# Altium schematic sheet 04-Control Circuit.schdoc
size 307 x 218 mm; Symbol: muban; Device: muban; @Project Name: 12345678; @Create Date: 2025-07-10; @Schematic Name: Mini Oscilloscope; @Page Count: 5; @Update Date: 2025-07-12; @Update Time: 08:21:58; @Page Name: 04-Control Circuit; @Page No: 4; @Create Time: 07:27:05; @Board Name: Base Board; Title Block Position: 3; Width: 1170; Height: 825; Region Start: 1; X Region Count: 6; Y Region Count: 4; Blade Width: 10; Description: 模拟题模板
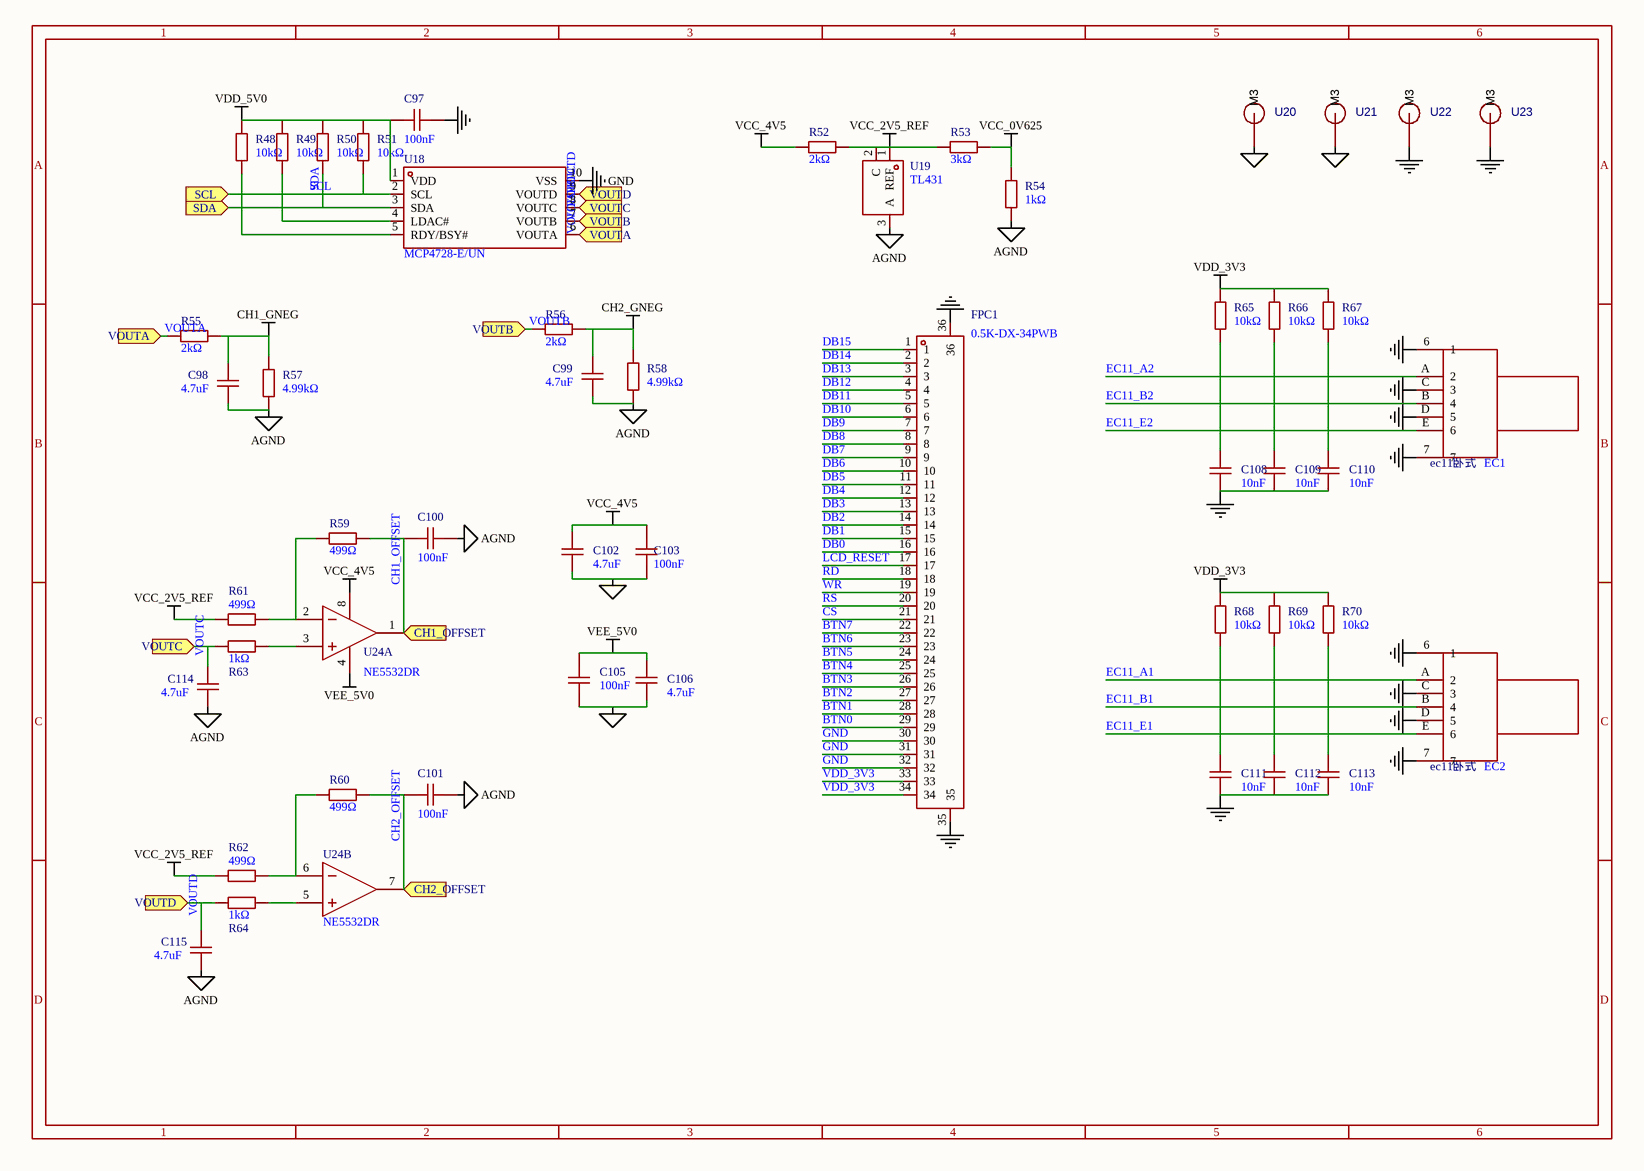
[diagram p0: 04-Control Circuit.schdoc]

## Parts
C97  100nF  [C0603]
C98  4.7uF  [C0603]
C99  4.7uF  [C0603]
C100  100nF  [C0603]
C101  100nF  [C0603]
C102  4.7uF  [C0603]
C103  100nF  [C0603]
C105  100nF  [C0603]
C106  4.7uF  [C0603]
C108  10nF  [C0603]
C109  10nF  [C0603]
C110  10nF  [C0603]
C111  10nF  [C0603]
C112  10nF  [C0603]
C113  10nF  [C0603]
C114  4.7uF  [C0603]
C115  4.7uF  [C0603]
EC1  (no value)  [ec11卧式立式编码器]
EC2  (no value)  [ec11卧式立式编码器]
FPC1  0.5K-DX-34PWB  [FPC-SMD_F0502-B-34-15T-R]
R48  10kΩ  [R0603]
R49  10kΩ  [R0603]
R50  10kΩ  [R0603]
R51  10kΩ  [R0603]
R52  2kΩ  [R0603]
R53  3kΩ  [R0603]
R54  1kΩ  [R0603]
R55  2kΩ  [R0603]
R56  2kΩ  [R0603]
R57  4.99kΩ  [R0603]
R58  4.99kΩ  [R0603]
R59  499Ω  [R0603]
R60  499Ω  [R0603]
R61  499Ω  [R0603]
R62  499Ω  [R0603]
R63  1kΩ  [R0603]
R64  1kΩ  [R0603]
R65  10kΩ  [R0603]
R66  10kΩ  [R0603]
R67  10kΩ  [R0603]
R68  10kΩ  [R0603]
R69  10kΩ  [R0603]
R70  10kΩ  [R0603]
U18  MCP4728-E/UN  [MSOP-10_L3.0-W3.0-P0.50-LS5.0-TL]
U19  TL431  [SOT-23-3_L3.0-W1.7-P0.95-LS2.9-BR]
U20  (no value)  [M3螺柱]
U21  (no value)  [M3螺柱]
U22  (no value)  [M3螺柱]
U23  (no value)  [M3螺柱]
U24  NE5532DR  [SOIC-8_L4.9-W3.9-P1.27-LS6.0-BL]  (parts A,B of 2)

## Ports
CH1_OFFSET (in), CH2_OFFSET (in), SCL (in), SDA (in), VOUTA (in), VOUTB (in), VOUTC (in), VOUTD (in)

## Nets
AGND: C98.1 C99.1 C100.1 C101.1 C102.1 C103.1 C105.1 C106.1 C114.1 C115.1 R54.1 R57.1 R58.1 U19.3(A) U20.1(M3) U21.1(M3)
CH1_GNEG: C98.2 R55.1 R57.2
CH2_GNEG: C99.2 R56.1 R58.2
GND: C97.1 C108.1 C109.1 C110.1 C111.1 C112.1 C113.1 EC1.6(1) EC1.7 EC1.C(3) EC1.D(5) EC2.6(1) EC2.7 EC2.C(3) EC2.D(5) FPC1.30 FPC1.31 FPC1.32 FPC1.35 FPC1.36 U18.10(VSS) U22.1(M3) U23.1(M3)
VCC_0V625: R53.2 R54.2
VCC_2V5_REF: R52.1 R53.1 R61.1 R62.1 U19.1(REF) U19.2(C)
VCC_4V5: C102.2 C103.2 R52.2 U24.8(VCC+)
VDD_3V3: FPC1.33 FPC1.34 R65.2 R66.2 R67.2 R68.2 R69.2 R70.2
VDD_5V0: C97.2 R48.2 R49.2 R50.2 R51.2 U18.1(VDD)
VEE_5V0: C105.2 C106.2 U24.4(VCC-/GND)
BTN0: FPC1.29
BTN1: FPC1.28
BTN2: FPC1.27
BTN3: FPC1.26
BTN4: FPC1.25
BTN5: FPC1.24
BTN6: FPC1.23
BTN7: FPC1.22
CH1_OFFSET: C100.2 R59.2 U24.1(OUT1) ; port CH1_OFFSET
CH2_OFFSET: C101.2 R60.2 U24.7(OUT2) ; port CH2_OFFSET
CS: FPC1.21
DB0: FPC1.16
DB1: FPC1.15
DB2: FPC1.14
DB3: FPC1.13
DB4: FPC1.12
DB5: FPC1.11
DB6: FPC1.10
DB7: FPC1.9
DB8: FPC1.8
DB9: FPC1.7
DB10: FPC1.6
DB11: FPC1.5
DB12: FPC1.4
DB13: FPC1.3
DB14: FPC1.2
DB15: FPC1.1
EC11_A1: C111.2 EC2.A(2) R68.1
EC11_A2: C108.2 EC1.A(2) R65.1
EC11_B1: C112.2 EC2.B(4) R69.1
EC11_B2: C109.2 EC1.B(4) R66.1
EC11_E1: C113.2 EC2.E(6) R70.1
EC11_E2: C110.2 EC1.E(6) R67.1
LCD_RESET: FPC1.17
RD: FPC1.18
RS: FPC1.20
SCL: R51.1 U18.2(SCL) ; port SCL
SDA: R50.1 U18.3(SDA) ; port SDA
VOUTA: R55.2 U18.6(VOUTA) ; port VOUTA
VOUTB: R56.2 U18.7(VOUTB) ; port VOUTB
VOUTC: C114.2 R63.1 U18.8(VOUTC) ; port VOUTC
VOUTD: C115.2 R64.1 U18.9(VOUTD) ; port VOUTD
WR: FPC1.19
NetR48_1: R48.1 U18.5(RDY/BSY#)
NetR49_1: R49.1 U18.4(LDAC#)
NetR59_1: R59.1 R61.2 U24.2(IN1-)
NetR60_1: R60.1 R62.2 U24.6(IN2-)
NetR63_2: R63.2 U24.3(IN1+)
NetR64_2: R64.2 U24.5(IN2+)

## Notes on the sheet
- 1
- 2
- 3
- 4
- 5
- 6
- A
- B
- C
- D

## Library data of the parts
C97 C103 C105 = CGA0603X7R104K500JT: Manufacturer: HRE(芯声); Symbol: CC0603KRX7R9BB104; Add into BOM: yes; Tolerance: ±10%; Voltage Rated: 50V; Temperature Coefficient: X7R; Device: CGA0603X7R104K500JT; LCSC Part Name: 100nF ±10% 50V; Supplier Part: C6119867; Manufacturer Part: CGA0603X7R104K500JT; Supplier Footprint: 0603; JLCPCB Part Class: Extended Part; Datasheet: https://atta.szlcsc.com/upload/public/pdf/source/20250103/C44077DA9E7B3EFAE02F22B6D3D1CBC9.pdf; Supplier: LCSC; Convert to PCB: yes; Value: 100nF; Voltage Rating: 50V
C98 C99 C102 C106 C114 C115 = CL10A475KO8NNNC: Manufacturer: SAMSUNG(三星); Add into BOM: yes; Tolerance: ±10%; Voltage Rated: 16V; Temperature Coefficient: X5R; Symbol: CL10A475KO8NNNC; Device: CL10A475KO8NNNC; LCSC Part Name: 4.7uF ±10% 16V; Supplier Part: C19666; Manufacturer Part: CL10A475KO8NNNC; Supplier Footprint: 0603; JLCPCB Part Class: Basic Part; Datasheet: https://atta.szlcsc.com/upload/public/pdf/source/20160218/1457707763339.pdf; Supplier: LCSC; Convert to PCB: yes; Value: 4.7uF
C100 C101 = CGA0603X7R104K500JT: Manufacturer: HRE(芯声); Add into BOM: yes; Tolerance: ±10%; Voltage Rated: 50V; Temperature Coefficient: X7R; Symbol: CGA0603X7R104K500JT; Device: CGA0603X7R104K500JT; LCSC Part Name: 100nF ±10% 50V; Supplier Part: C6119867; Manufacturer Part: CGA0603X7R104K500JT; Supplier Footprint: 0603; JLCPCB Part Class: Extended Part; Datasheet: https://atta.szlcsc.com/upload/public/pdf/source/20250103/C44077DA9E7B3EFAE02F22B6D3D1CBC9.pdf; Supplier: LCSC; Convert to PCB: yes; Value: 100nF; Voltage Rating: 50V
C108-C113 = CC0603KRX7R9BB103: Manufacturer: YAGEO(国巨); Add into BOM: yes; Tolerance: ±10%; Voltage Rated: 50V; Temperature Coefficient: X7R; Symbol: CC0603KRX7R9BB103; Device: CC0603KRX7R9BB103; LCSC Part Name: 10nF ±10% 50V; Supplier Part: C100042; Manufacturer Part: CC0603KRX7R9BB103; Supplier Footprint: 0603; JLCPCB Part Class: Extended Part; Datasheet: https://atta.szlcsc.com/upload/public/pdf/source/20181008/C309510_22F155564471FAF6A489F7D68F34234E.pdf; Supplier: LCSC; Convert to PCB: yes; Value: 10nF
EC1 EC2 = ec11卧式: Symbol: ec11卧式 厚底 带开关; Add into BOM: yes; Device: ec11卧式; Convert to PCB: yes
FPC1 = 0.5K-DX-34PWB: Manufacturer: HDGC(华德共创); Symbol: F0502-B-34-15T-R; Add into BOM: yes; Locking Feature: 翻盖式; Number of Contacts: 34P; Pitch: 0.5mm; FFC, FCB Thickness: 0.3mm; Device: 0.5K-DX-34PWB; LCSC Part Name: 间距:0.5mm P数:34P 翻盖式 下接; Supplier Part: C2911857; Manufacturer Part: 0.5K-DX-34PWB; Supplier Footprint: SMD,P=0.5mm,卧贴; JLCPCB Part Class: Extended Part; Datasheet: https://atta.szlcsc.com/upload/public/pdf/source/20211029/5210AEC837E1AC9B697C39805C1E664F.pdf; Supplier: LCSC; Convert to PCB: yes; Contact Type: 下接; Mounting Type: 卧贴; Height Above Board: 2mm; Operating Temperature Range: -20℃~+85℃
R48-R51 R65-R70 = 0603WAF1002T5E: Manufacturer: UNI-ROYAL(厚声); Add into BOM: yes; Tolerance: ±1%; Power(Watts): 100mW; Temperature Coefficient: ±100ppm/℃; Overload Voltage (Max): 75V; Symbol: 0603WAF1002T5E; Device: 0603WAF1002T5E; LCSC Part Name: 厚膜电阻 10kΩ ±1% 100mW; Supplier Part: C25804; Manufacturer Part: 0603WAF1002T5E; Supplier Footprint: 0603; JLCPCB Part Class: Basic Part; Datasheet: https://atta.szlcsc.com/upload/public/pdf/source/20200306/C422600_1E6D84923E4A46A82E41ADD87F860B5C.pdf; Supplier: LCSC; Convert to PCB: yes; Type: 厚膜电阻; Value: 10kΩ; Operating Temperature Range: -55℃~+155℃
R52 R55 R56 = 0603WAF2001T5E: Manufacturer: UNI-ROYAL(厚声); Add into BOM: yes; Tolerance: ±1%; Power(Watts): 100mW; Overload Voltage (Max): 75V; Temperature Coefficient: ±100ppm/℃; Symbol: 0603WAF2001T5E; Device: 0603WAF2001T5E; LCSC Part Name: 2kΩ ±1% 100mW 厚膜电阻; Supplier Part: C22975; Manufacturer Part: 0603WAF2001T5E; Supplier Footprint: 0603; JLCPCB Part Class: Basic Part; Datasheet: https://atta.szlcsc.com/upload/public/pdf/source/20200306/C422600_1E6D84923E4A46A82E41ADD87F860B5C.pdf; Supplier: LCSC; Convert to PCB: yes; Type: 厚膜电阻; Value: 2kΩ; Operating Temperature Range: -55℃~+155℃
R53 = 0603WAF3001T5E: Manufacturer: UNI-ROYAL(厚声); Add into BOM: yes; Tolerance: ±1%; Power(Watts): 100mW; Overload Voltage (Max): 75V; Temperature Coefficient: ±100ppm/℃; Symbol: 0603WAF3001T5E; Device: 0603WAF3001T5E; LCSC Part Name: 3kΩ ±1% 100mW 厚膜电阻; Supplier Part: C4211; Manufacturer Part: 0603WAF3001T5E; Supplier Footprint: 0603; JLCPCB Part Class: 基础库; Datasheet: https://atta.szlcsc.com/upload/public/pdf/source/20200306/C422600_1E6D84923E4A46A82E41ADD87F860B5C.pdf; Supplier: LCSC; Convert to PCB: yes; Type: 厚膜电阻; Value: 3kΩ; Operating Temperature Range: -55℃~+155℃
R54 R63 R64 = 0603WAF1001T5E: Manufacturer: UNI-ROYAL(厚声); Add into BOM: yes; Tolerance: ±1%; Power(Watts): 100mW; Overload Voltage (Max): 75V; Temperature Coefficient: ±100ppm/℃; Symbol: 0603WAF1001T5E; Device: 0603WAF1001T5E; LCSC Part Name: 1kΩ ±1% 100mW 厚膜电阻; Supplier Part: C21190; Manufacturer Part: 0603WAF1001T5E; Supplier Footprint: 0603; JLCPCB Part Class: Basic Part; Datasheet: https://atta.szlcsc.com/upload/public/pdf/source/20200306/C422600_1E6D84923E4A46A82E41ADD87F860B5C.pdf; Supplier: LCSC; Convert to PCB: yes; Type: 厚膜电阻; Value: 1kΩ; Operating Temperature Range: -55℃~+155℃
R57 R58 = 0603WAF4991T5E: Manufacturer: UNI-ROYAL(厚声); Add into BOM: yes; Tolerance: ±1%; Power(Watts): 100mW; Overload Voltage (Max): 75V; Temperature Coefficient: ±100ppm/℃; Symbol: 0603WAF4991T5E; Device: 0603WAF4991T5E; LCSC Part Name: 4.99kΩ ±1% 100mW 厚膜电阻; Supplier Part: C23046; Manufacturer Part: 0603WAF4991T5E; Supplier Footprint: 0603; JLCPCB Part Class: 基础库; Datasheet: https://atta.szlcsc.com/upload/public/pdf/source/20200306/C422600_1E6D84923E4A46A82E41ADD87F860B5C.pdf; Supplier: LCSC; Convert to PCB: yes; Type: 厚膜电阻; Value: 4.99kΩ; Operating Temperature Range: -55℃~+155℃
R59-R62 = 0603WAF4990T5E: Manufacturer: UNI-ROYAL(厚声); Add into BOM: yes; Tolerance: ±1%; Power(Watts): 100mW; Overload Voltage (Max): 75V; Temperature Coefficient: ±100ppm/℃; Symbol: 0603WAF4990T5E; Device: 0603WAF4990T5E; LCSC Part Name: 499Ω ±1% 100mW 厚膜电阻; Supplier Part: C23065; Manufacturer Part: 0603WAF4990T5E; Supplier Footprint: 0603; JLCPCB Part Class: 扩展库; Datasheet: https://atta.szlcsc.com/upload/public/pdf/source/20200306/C422600_1E6D84923E4A46A82E41ADD87F860B5C.pdf; Supplier: LCSC; Convert to PCB: yes; Type: 厚膜电阻; Value: 499Ω; Operating Temperature Range: -55℃~+155℃
U18 = MCP4728-E/UN: Manufacturer: MICROCHIP(美国微芯); Add into BOM: yes; Interface: I2C; Output Type: 电压-缓冲; Supply Voltage: 2.7V~5.5V; Resolution: 12位; Integral nonlinearity: ±0.2LSB；±2LSB; Settling Time: 6us; Symbol: MCP4728-E/UN; Device: MCP4728-E/UN; LCSC Part Name: MCP4728-E/UN; Supplier Part: C108207; Manufacturer Part: MCP4728-E/UN; Supplier Footprint: MSOP-10; JLCPCB Part Class: 扩展库; Datasheet: https://atta.szlcsc.com/upload/public/pdf/source/20180207/C108207_15179947749381359004.pdf; Supplier: LCSC; Convert to PCB: yes; Number of Channels: -; Operating Temperature: -40℃~+125℃
U19 = TL431_C181103: Manufacturer: Hottech(合科泰); Add into BOM: yes; Output Type: 可调; Output Voltage: 2.5V~36V; Output Current: 100mA; Minimum Cathode Current for Regulation: 1mA; Symbol: TL431_C181103; Device: TL431_C181103; LCSC Part Name: TL431; Supplier Part: C181103; Manufacturer Part: TL431; Supplier Footprint: SOT-23; JLCPCB Part Class: 扩展库; Datasheet: https://atta.szlcsc.com/upload/public/pdf/source/20220427/4F1D45E1F0D60AF688A54057C5935F69.pdf; Supplier: LCSC; Convert to PCB: yes; Operating Temperature: 0℃~+70℃@(TA)
U20-U23 = M3螺柱: Symbol: M3螺柱孔_JX; Convert to PCB: yes; Device: M3螺柱; Add into BOM: yes
U24 = NE5532DR: Manufacturer: TI(德州仪器); Add into BOM: yes; Number of Circuits: 双路; Gain Bandwidth Product(GBP): 10MHz; Current - Input Bias(Ib): 200nA; Slew Rate(SR): 9V/us; Output Current: 38mA; Supply Current: 8mA; Relevance: []; Symbol: NE5532DR; Device: NE5532DR; LCSC Part Name: NE5532DR; Supplier Part: C7426; Manufacturer Part: NE5532DR; Supplier Footprint: SOIC-8; JLCPCB Part Class: 基础库; Datasheet: http://www.ti.com/cn/lit/gpn/ne5532; Supplier: LCSC; Convert to PCB: yes; -3db Bandwidth: -; Operating Temperature: 0℃~+70℃